# Altium schematic sheet Connectors.SchDoc
size 355 x 228 mm; DocumentNumber: 3; SheetNumber: 3; SheetTotal: 16
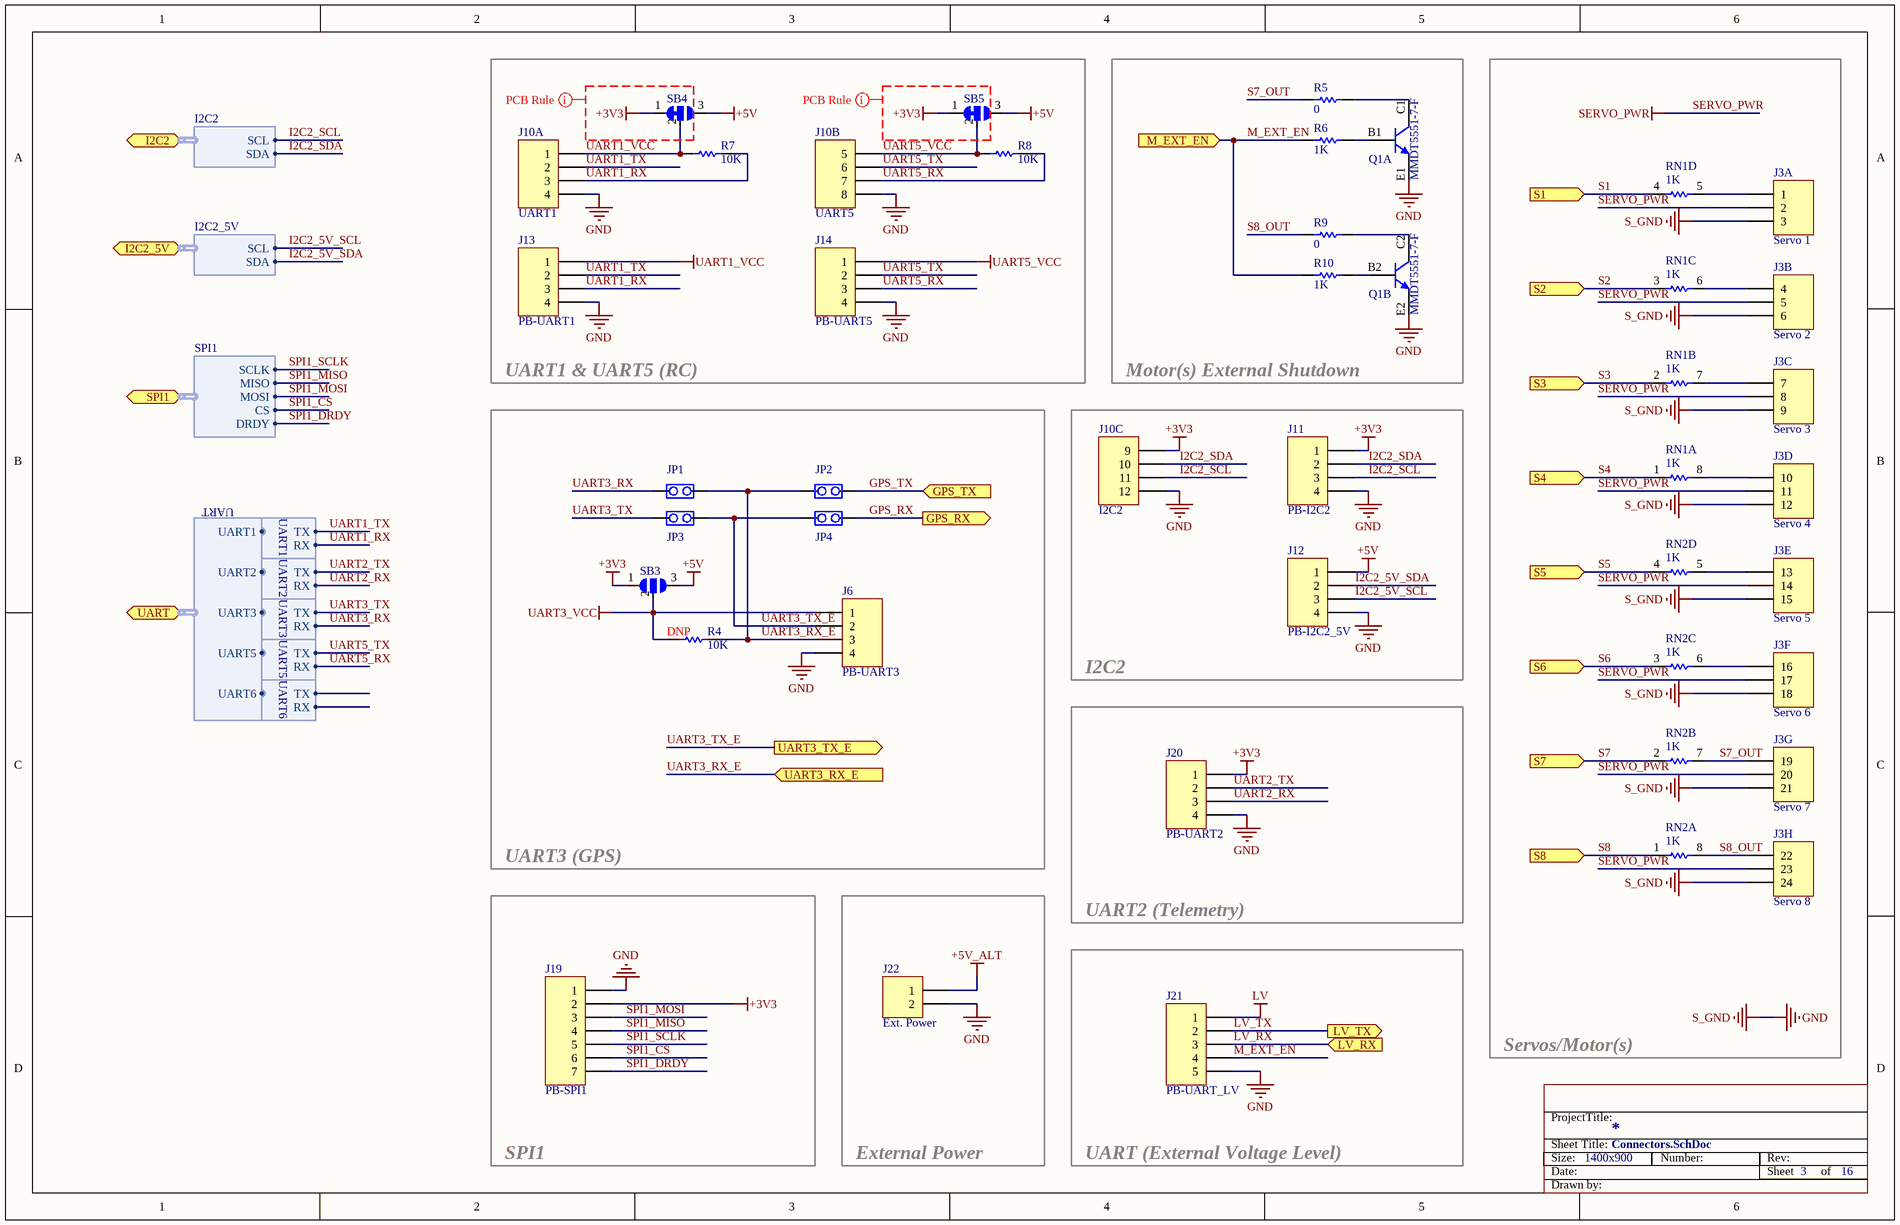
[diagram p0: Connectors.SchDoc]

## Parts
J3  Servo  [HDR_3x08_RA]  (value not drawn)  (parts A,B,C,D,E,F,G,H of 8)  (no BOM)
J6  PB-UART3  [PICOBLADE_1X04_VERT_SMD]
J10  Header  [HDR_3x04_RA]  (value not drawn)  (parts A,B,C of 3)  (no BOM)
J11  PB-I2C2  [PICOBLADE_1X04_VERT_SMD]
J12  PB-I2C2_5V  [PICOBLADE_1X04_VERT_SMD]
J13  PB-UART1  [PICOBLADE_1X04_VERT_SMD]
J14  PB-UART5  [PICOBLADE_1X04_VERT_SMD]
J19  PB-SPI1  [PICOBLADE_1X07_VERT_SMD]
J20  PB-UART2  [PICOBLADE_1X04_VERT_SMD]
J21  PB-UART_LV  [PICOBLADE_1X05_VERT_SMD]
J22  Ext. Power  [HDR_1x02]  (no BOM)
JP1  Jumper  [HDR_1x02_JMP]  (value not drawn)  (no BOM)
JP2  Jumper  [HDR_1x02_JMP]  (value not drawn)  (no BOM)
JP3  Jumper  [HDR_1x02_JMP]  (value not drawn)  (no BOM)
JP4  Jumper  [HDR_1x02_JMP]  (value not drawn)  (no BOM)
Q1  Manufacturer Part Number: MMDT5551-7-F  [SOT363-6]  (hidden comment: BJT NPN DUAL)  (parts A,B of 2)
R4  value 10K  Note: DNP  [RES_0402[1005M]]  (hidden comment: RES)
R5  value 0  [JUMPER_RES_0402]  (hidden comment: RES)
R6  value 1K  [RES_0402[1005M]]  (hidden comment: RES)
R7  value 10K  [RES_0402[1005M]]  (hidden comment: RES)
R8  value 10K  [RES_0402[1005M]]  (hidden comment: RES)
R9  value 0  [JUMPER_RES_0402]  (hidden comment: RES)
R10  value 1K  [RES_0402[1005M]]  (hidden comment: RES)
RN1  value 1K  [RES ARRAY SMD]  (hidden comment: Res Network 1)  (parts A,B,C,D of 4)
RN2  value 1K  [RES ARRAY SMD]  (hidden comment: Res Network 1)  (parts A,B,C,D of 4)
SB3  SMD Jumper 1  [SMD JUMPER 1]  (value not drawn)  (no BOM)
SB4  SMD Jumper 2  [SMD JUMPER 2]  (value not drawn)  (no BOM)
SB5  SMD Jumper 2  [SMD JUMPER 2]  (value not drawn)  (no BOM)

## Blocks framed on the sheet
UART1 & UART5 (RC): J10 J13 J14 R7 R8 SB4 SB5
Motor(s) External Shutdown: Q1 R5 R6 R9 R10
Servos/Motor(s): J3 RN1 RN2
UART3 (GPS): J6 JP1-JP4 R4 SB3
I2C2: J10-J12
UART2 (Telemetry): J20
SPI1: J19
External Power: J22
UART (External Voltage Level): J21

## Ports
GPS_RX (out), GPS_TX (in), I2C2 (harness I2C2), I2C2_5V (harness I2C2_5V), LV_RX (in), LV_TX (out), M_EXT_EN (in), S1 (in), S2 (in), S3 (in), S4 (in), S5 (in), S6 (in), S7 (in), S8 (in), SPI1 (harness SPI1), UART3_RX_E (in), UART3_TX_E (out), UART (harness UART)

## Harnesses
I2C2: SDA, SCL
I2C2_5V: SDA, SCL
UART2: TX, RX
UART3: TX, RX
UART1: TX, RX
UART5: TX, RX
UART6: TX, RX
UART: UART1, UART2, UART3, UART5, UART6
SPI1: SCLK, MOSI, MISO, CS, DRDY

## Nets
+3V3: J10.9 J11.1 J19.2 J20.1 SB3.1 SB4.1 SB5.1
+5V: J12.1 SB3.3 SB4.3 SB5.3
+5V_ALT: J22.1
GND: J3.3 J3.6 J3.9 J3.12 J3.15 J3.18 J3.21 J3.24 J6.4 J10.4 J10.8 J10.12 J11.4 J12.4 J13.4 J14.4 J19.1 J20.4 J21.5 J22.2 Q1.E1 Q1.E2  [also labelled S_GND]
LV: J21.1
SERVO_PWR: J3.2 J3.5 J3.8 J3.11 J3.14 J3.17 J3.20 J3.23
UART1_VCC: J10.1 J13.1 R7.2 SB4.2
UART3_VCC: J6.1 R4.2 SB3.2
UART5_VCC: J10.5 J14.1 R8.2 SB5.2
GPS_RX: JP4.1 ; port GPS_RX
GPS_TX: JP2.1 ; port GPS_TX
I2C2_5V_SCL: J12.3 ; port I2C2_5V.SCL
I2C2_5V_SDA: J12.2 ; port I2C2_5V.SDA
I2C2_SCL: J10.11 J11.3 ; port I2C2.SCL
I2C2_SDA: J10.10 J11.2 ; port I2C2.SDA
LV_RX: J21.3 ; port LV_RX
LV_TX: J21.2 ; port LV_TX
M_EXT_EN: J21.4 R6.2 R10.2 ; port M_EXT_EN
S1: RN1.4 ; port S1
S2: RN1.3 ; port S2
S3: RN1.2 ; port S3
S4: RN1.1 ; port S4
S5: RN2.4 ; port S5
S6: RN2.3 ; port S6
S7: RN2.2 ; port S7
S7_OUT: J3.19 R5.2 RN2.7
S8: RN2.1 ; port S8
S8_OUT: J3.22 R9.2 RN2.8
SPI1_CS: J19.6 ; port SPI1.CS
SPI1_DRDY: J19.7 ; port SPI1.DRDY
SPI1_MISO: J19.4 ; port SPI1.MISO
SPI1_MOSI: J19.3 ; port SPI1.MOSI
SPI1_SCLK: J19.5 ; port SPI1.SCLK
UART1_RX: J10.3 J13.3 R7.1 ; harness UART1.RX
UART1_TX: J10.2 J13.2 ; harness UART1.TX
UART2_RX: J20.3 ; harness UART2.RX
UART2_TX: J20.2 ; harness UART2.TX
UART3_RX: JP1.1 ; harness UART3.RX
UART3_RX_E: J6.3 JP1.2 JP2.2 R4.1 ; port UART3_RX_E
UART3_TX: JP3.1 ; harness UART3.TX
UART3_TX_E: J6.2 JP3.2 JP4.2 ; port UART3_TX_E
UART5_RX: J10.7 J14.3 R8.1 ; harness UART5.RX
UART5_TX: J10.6 J14.2 ; harness UART5.TX
NetJ3_1: J3.1 RN1.5
NetJ3_4: J3.4 RN1.6
NetJ3_7: J3.7 RN1.7
NetJ3_10: J3.10 RN1.8
NetJ3_13: J3.13 RN2.5
NetJ3_16: J3.16 RN2.6
NetQ1_B1: Q1.B1 R6.1
NetQ1_B2: Q1.B2 R10.1
NetQ1_C1: Q1.C1 R5.1
NetQ1_C2: Q1.C2 R9.1

## Layout directives
rule Short-Circuit Constraint [Short Circuit - Allowed]: +3V3

## Notes on the sheet
- (near J10) UART1
- (near J10) UART5
- (near J3) Servo 1
- (near J3) Servo 2
- (near J3) Servo 3
- (near J10) I2C2
- (near J3) Servo 4
- (near J3) Servo 5
- (near J3) Servo 6
- (near J3) Servo 7
- (near J3) Servo 8
- Sheet Title:
- ProjectTitle:
- Size:
- Date:
- 1400x900
- Number:
- Rev:
- Sheet         of
- Drawn by:

## Library data of the parts
J3 = Header 3X08 RA: Header, 24-Pin
J6 J11-J14 J20 = Header 4: Header, 4-Pin; Manufacturer: Molex, LLC; Manufacturer Part Number: 0533980471; Supplier 1: Digi-Key; Supplier Part Number 1: WM7608CT-ND; ComponentLink1URL: http://www.molex.com/pdm_docs/sd/533980471_sd.pdf; ComponentLink1Description: Datasheet
J10 = Header 3X04 RA: Header, 12-Pin
J19 = Header 7: Header, 7-Pin; Manufacturer: Molex, LLC; Manufacturer Part Number: 0533980771; Supplier 1: Digi-Key; Supplier Part Number 1: WM7611CT-ND; ComponentLink1URL: http://www.molex.com/pdm_docs/sd/533980771_sd.pdf; ComponentLink1Description: Datasheet
J21 = Header 5: Header, 5-Pin; Manufacturer Part Number: 0533980571; Manufacturer: Molex, LLC; Supplier 1: Digi-Key; Supplier Part Number 1: WM7609CT-ND; ComponentLink1URL: http://www.molex.com/pdm_docs/sd/533980571_sd.pdf; ComponentLink1Description: Datasheet
J22 = Header 2: Header, 2-Pin
Q1 = BJT NPN DUAL: NPN General Purpose Amplifier; pin to pad: B1>5 B2>2 C1>3 C2>6 E1>4 E2>1; Manufacturer: Diodes Incorporated; Current - Collector (Ic) (Max): 200mA; DC Current Gain (hFE) (Min) @ Ic, Vce: 80 @ 10mA, 5V; Power - Max: 200mW; Vce Saturation (Max) @ Ib, Ic: 200mV @ 5mA, 50mA; Current - Collector Cutoff (Max): 50nA (ICBO); Voltage - Collector Emitter Breakdown (Max): 160V; Frequency - Transition: 300MHz; Supplier 1: Digi-Key; Supplier Part Number 1: MMDT5551-FDICT-ND; ComponentLink1URL: http://www.diodes.com/_files/datasheets/ds30172.pdf; ComponentLink1Description: Datasheet
R4 R7 R8 = RES: Resistor; Manufacturer: Yageo; Manufacturer Part Number: RC0402FR-0710KL; Supplier 1: Digi-Key; Supplier Part Number 1: 311-10.0KLRCT-ND; ComponentLink1URL: http://www.yageo.com/NewPortal/yageodocoutput?fileName=/pdf/R-Chip/PYu-RC_Group_51_RoHS_L_3.pdf; ComponentLink1Description: Datasheet
R5 R9 = RES: Resistor; Manufacturer Part Number: RC0402JR-070RL; Manufacturer: Yageo; Supplier 1: Digi-Key; Supplier Part Number 1: 311-0.0JRCT-ND; ComponentLink1URL: http://www.yageo.com/NewPortal/yageodocoutput?fileName=/pdf/R-Chip/PYu-RC_Group_51_RoHS_L_3.pdf; ComponentLink1Description: Datasheet
R6 R10 = RES: Resistor; Manufacturer: Yageo; Manufacturer Part Number: RC0402FR-071KL; Supplier 1: Digi-Key; Supplier Part Number 1: 311-1.00KLRCT-ND; ComponentLink1URL: http://www.yageo.com/NewPortal/yageodocoutput?fileName=/pdf/R-Chip/PYu-RC_Group_51_RoHS_L_3.pdf; ComponentLink1Description: Datasheet
RN1 RN2 = Res Network 1: Isolated Resistor Network; Manufacturer Part Number: YC164-JR-071KL; Manufacturer: Yageo; Supplier 1: Digi-Key; Supplier Part Number 1: YC164J-1.0KCT-ND; ComponentLink1URL: http://www.yageo.com/NewPortal/yageodocoutput?fileName=/pdf/R-Chip/PYu-YC_TC_group_51_RoHS_L_0.pdf; ComponentLink1Description: Datasheet
SB3 = SMD Jumper 1: SMD Jumper 3 positions. Open
SB4 SB5 = SMD Jumper 2: SMD Jumper 3 positions. Closed